# Altium schematic sheet ULN2803_C27580141_ULN2803_C2758014.schdoc
size 124 x 101 mm
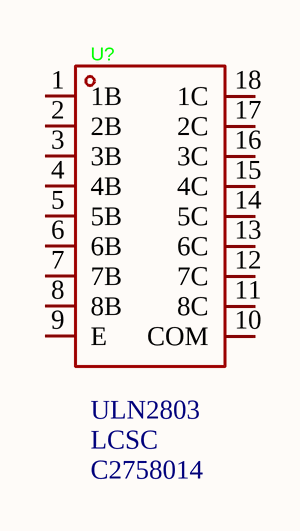
[diagram p0: ULN2803_C27580141_ULN2803_C2758014.schdoc]

## Parts
U?  Supplier Part: C2758014  Supplier: LCSC  [SOP-18_L11.6-W7.5-P1.27-LS10.3-BL]  (hidden comment: ULN2803)

## Nets

Not connected (* = marked no-connect by the designer): U? 1(1B) 2(2B) 3(3B) 4(4B) 5(5B) 6(6B) 7(7B) 8(8B) 9(E) 10(COM) 11(8C) 12(7C) 13(6C) 14(5C) 15(4C) 16(3C) 17(2C) 18(1C)

## Library data of the parts
U? = ULN2803_C2758014: Manufacturer: Siproin(上海矽朋); Add into BOM: yes; number of channels: 8; Collector - Emitter Voltage VCEO: 50V; Current - Collector(Ic): 500mA; Voltage - Input(Max): 30V; Input Current(off): 65uA; Voltage - Forward(Vf): 1.7V; Reverse Leakage Current (Ir): 100uA; Input Capacitiance(Ci): 15pF; Symbol: ULN2803_C2758014; Device: ULN2803_C2758014; Manufacturer Part: ULN2803; Supplier Footprint: SOP-18-300mil; LCSC Part Name: 高压大电流达林顿晶体管阵列; JLCPCB Part Class: Extended Part; Datasheet: https://item.szlcsc.com/datasheet/ULN2803/2875179.html; Convert to PCB: yes; Operating Temperature: -20℃~+70℃